# EAGLE design aduinobasic (EAGLE 6.3)
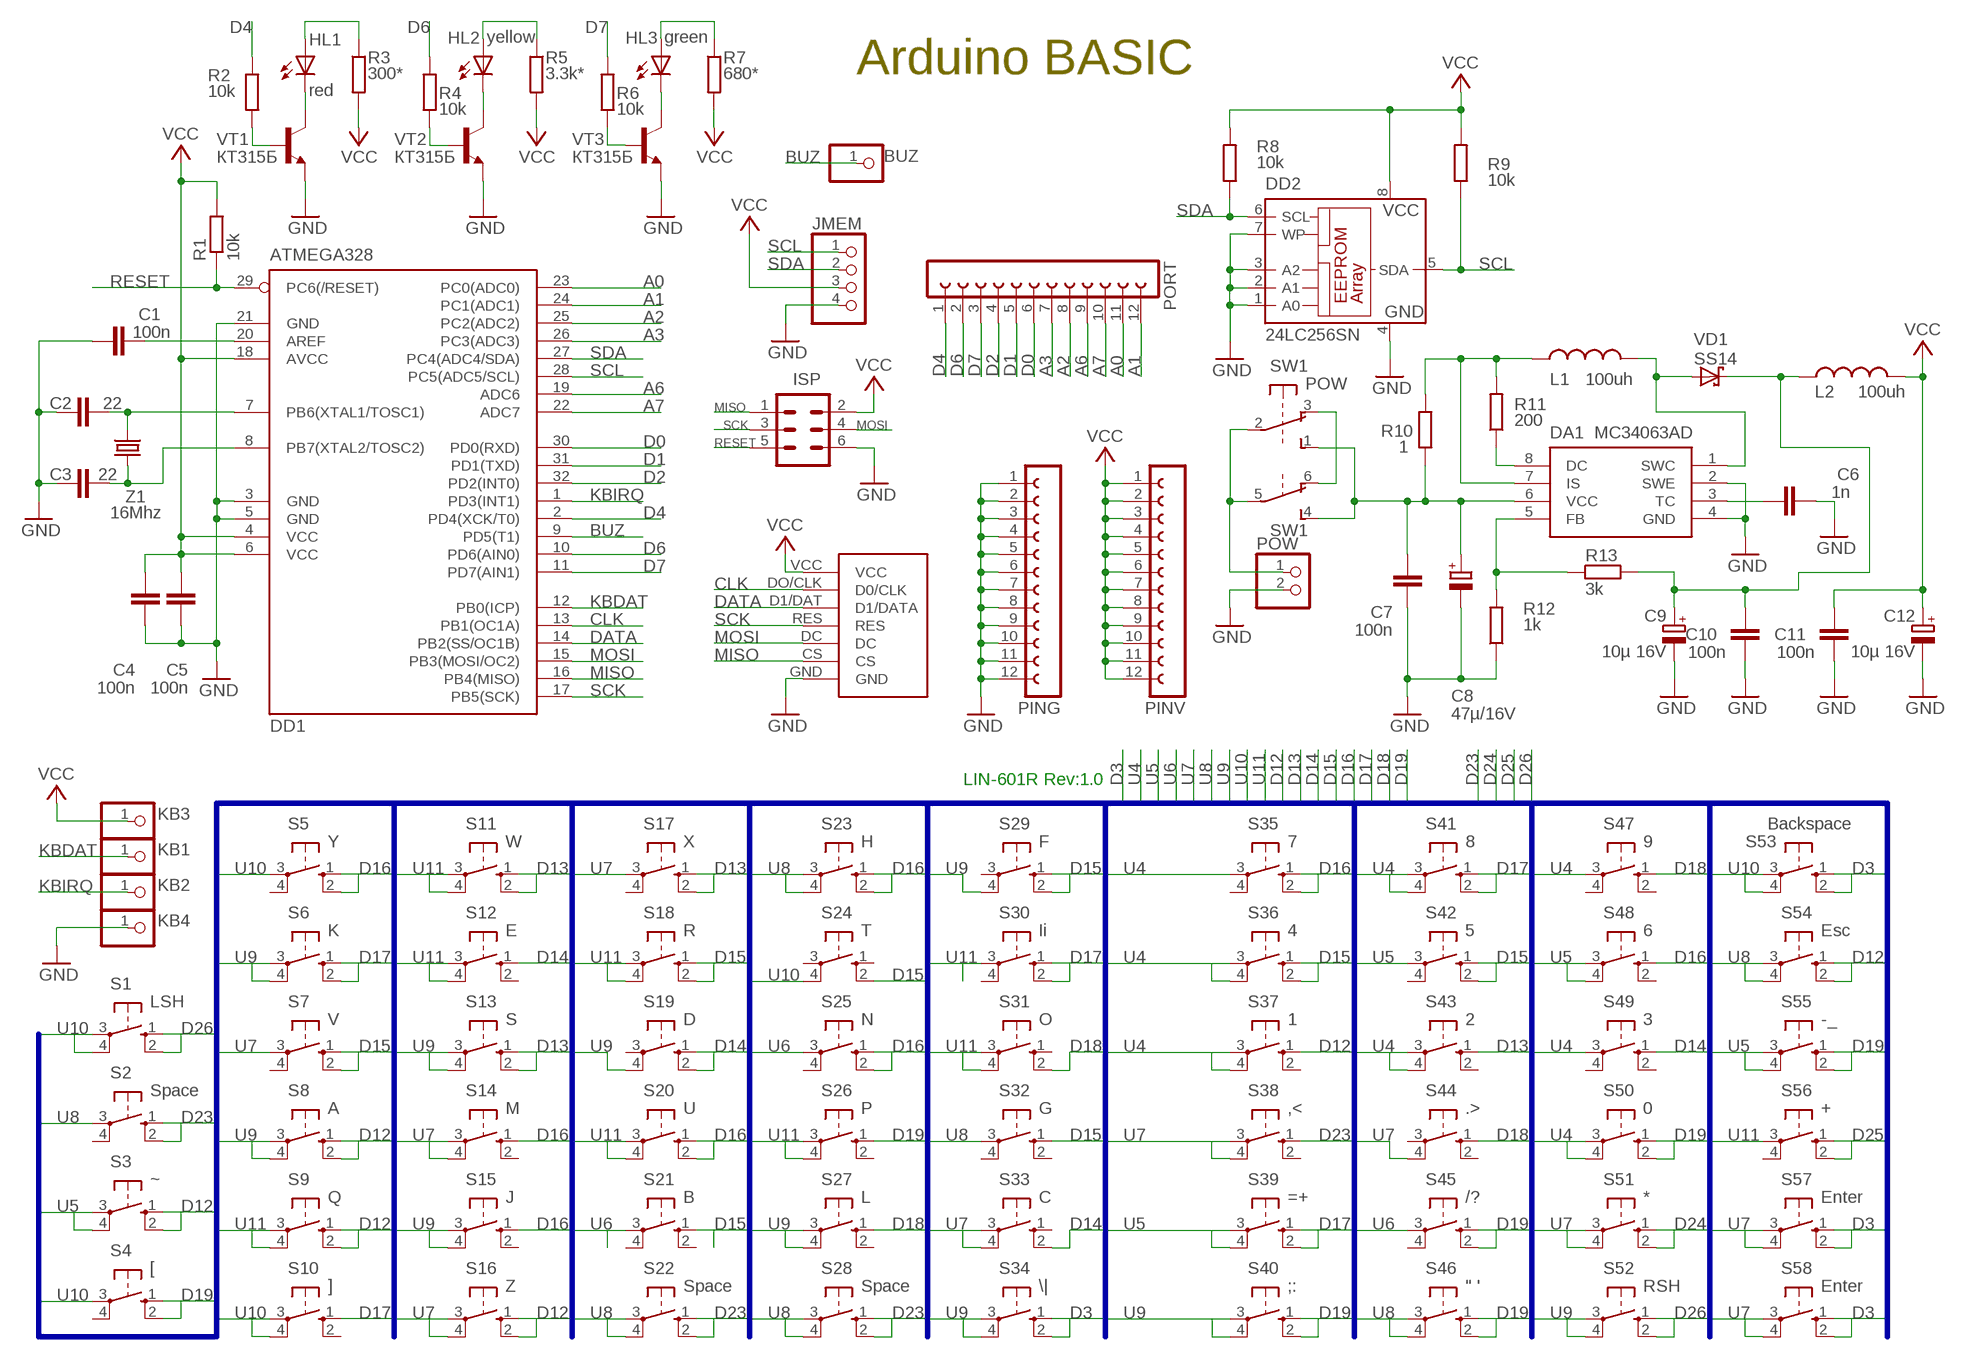
[diagram p0: schematic, sheet 1]

## Parts
BUZ  PINHD-1X1  [1X01]
C1  100n  C-EUC0805  [C0805]
C2  22  C-EU025-025X050  [C025-025X050]
C3  22  C-EU025-025X050  [C025-025X050]
C4  100n  C-EUC0805  [C0805]
C5  100n  C-EUC0805  [C0805]
C6  1n  C-EU025-025X050  [C025-025X050]
C7  100n  C-EUC1206  [C1206]
C8  47µ/16V  RCL_CPOL-EUE2-5  [RCL_E2-5]
C9  10µ 16V  RCL_CPOL-EUE2-5  [RCL_E2-5]
C10  100n  C-EUC1206  [C1206]
C11  100n  C-EUC1206  [C1206]
C12  10µ 16V  RCL_CPOL-EUE2-5  [RCL_E2-5]
DA1  MC34063AD  [SOIC8]
DD1  ATMEGA328  MEGA8-AI  [TQFP32-08]
DD2  24LC256SN  [SO-08]
DISPLAY  SSD1306  [SSD1306_0.96]
HL1  red  LED5MM  [LED5MM]
HL2  yellow  LED5MM  [LED5MM]
HL3  green  LED5MM  [LED5MM]
ISP  MA03-2  [MA03-2]
JMEM  PINHD-1X4  [1X04]
KB1  PINHD-1X1  [1X01]
KB2  PINHD-1X1  [1X01]
KB3  PINHD-1X1  [1X01]
KB4  PINHD-1X1  [1X01]
L1  100uh  L-US0207/10  [0207/10]
L2  100uh  L-US0204/5  [0204/5]
PING  FE12-1  [FE12]
PINV  FE12-1  [FE12]
PORT  FE12-1  [FE12]
POW  PINHD-1X2  [1X02]
R1  10k  R-EU_R0805  [R0805]
R2  10k  R-EU_R0805  [R0805]
R3  300*  R-EU_R1206W  [R1206W]
R4  10k  R-EU_R0805  [R0805]
R5  3.3k*  R-EU_R1206W  [R1206W]
R6  10k  R-EU_R0805  [R0805]
R7  680*  R-EU_R0805  [R0805]
R8  10k  R-EU_R0805  [R0805]
R9  10k  R-EU_R0805  [R0805]
R10  1  R-EU_M1206  [M1206]
R11  200  R-EU_M1206  [M1206]
R12  1k  R-EU_M0805  [M0805]
R13  3k  R-EU_M0805  [M0805]
S1  LSH  10-XX  [B3F-10XX]
S2  Space  10-XX  [B3F-10XX]
S3  ~  10-XX  [B3F-10XX]
S4  [  10-XX  [B3F-10XX]
S5  Y  10-XX  [B3F-10XX]
S6  K  10-XX  [B3F-10XX]
S7  V  10-XX  [B3F-10XX]
S8  A  10-XX  [B3F-10XX]
S9  Q  10-XX  [B3F-10XX]
S10  ]  10-XX  [B3F-10XX]
S11  W  10-XX  [B3F-10XX]
S12  E  10-XX  [B3F-10XX]
S13  S  10-XX  [B3F-10XX]
S14  M  10-XX  [B3F-10XX]
S15  J  10-XX  [B3F-10XX]
S16  Z  10-XX  [B3F-10XX]
S17  X  10-XX  [B3F-10XX]
S18  R  10-XX  [B3F-10XX]
S19  D  10-XX  [B3F-10XX]
S20  U  10-XX  [B3F-10XX]
S21  B  10-XX  [B3F-10XX]
S22  Space  10-XX  [B3F-10XX]
S23  H  10-XX  [B3F-10XX]
S24  T  10-XX  [B3F-10XX]
S25  N  10-XX  [B3F-10XX]
S26  P  10-XX  [B3F-10XX]
S27  L  10-XX  [B3F-10XX]
S28  Space  10-XX  [B3F-10XX]
S29  F  10-XX  [B3F-10XX]
S30  Ii  10-XX  [B3F-10XX]
S31  O  10-XX  [B3F-10XX]
S32  G  10-XX  [B3F-10XX]
S33  C  10-XX  [B3F-10XX]
S34  \|  10-XX  [B3F-10XX]
S35  7  10-XX  [B3F-10XX]
S36  4  10-XX  [B3F-10XX]
S37  1  10-XX  [B3F-10XX]
S38  ,<  10-XX  [B3F-10XX]
S39  =+  10-XX  [B3F-10XX]
S40  ;:  10-XX  [B3F-10XX]
S41  8  10-XX  [B3F-10XX]
S42  5  10-XX  [B3F-10XX]
S43  2  10-XX  [B3F-10XX]
S44  .>  10-XX  [B3F-10XX]
S45  /?  10-XX  [B3F-10XX]
S46  " '  10-XX  [B3F-10XX]
S47  9  10-XX  [B3F-10XX]
S48  6  10-XX  [B3F-10XX]
S49  3  10-XX  [B3F-10XX]
S50  0  10-XX  [B3F-10XX]
S51  *  10-XX  [B3F-10XX]
S52  RSH  10-XX  [B3F-10XX]
S53  Backspace  10-XX  [B3F-10XX]
S54  Esc  10-XX  [B3F-10XX]
S55  -_  10-XX  [B3F-10XX]
S56  +  10-XX  [B3F-10XX]
S57  Enter  10-XX  [B3F-10XX]
S58  Enter  10-XX  [B3F-10XX]
SW1  POW  9077-2  [9077-2]
VD1  SS14  SCHOTTKY-DIODESMD  [SMB]
VT1  КТ315Б  BC368-NPN-TO92-ECB  [TO92-ECB]
VT2  КТ315Б  BC368-NPN-TO92-ECB  [TO92-ECB]
VT3  КТ315Б  BC368-NPN-TO92-ECB  [TO92-ECB]
Z1  16Mhz  CRYSTALHC49S  [HC49/S]

## Nets
A0: DD1.23(PC0(ADC0)) PORT.11
A1: DD1.24(PC1(ADC1)) PORT.12
A2: DD1.25(PC2(ADC2)) PORT.8
A3: DD1.26(PC3(ADC3)) PORT.7
A6: DD1.19(ADC6) PORT.9
A7: DD1.22(ADC7) PORT.10
AREF: C1.2 DD1.20(AREF)
BUZ: BUZ.1 DD1.9(PD5(T1))
CLK: DD1.13(PB1(OC1A)) DISPLAY.DO/CLK(D0/CLK)
D0: DD1.30(PD0(RXD)) PORT.6
D1: DD1.31(PD1(TXD)) PORT.5
D2: DD1.32(PD2(INT0)) PORT.4
D3: S34.1(S) S34.2(S1) S53.1(S) S53.2(S1) S57.1(S) S57.2(S1) S58.1(S) S58.2(S1)
D4: DD1.2(PD4(XCK/T0)) PORT.1 R2.1
D6: DD1.10(PD6(AIN0)) PORT.2 R4.1
D7: DD1.11(PD7(AIN1)) PORT.3 R6.1
D12: S3.1(S) S3.2(S1) S8.1(S) S8.2(S1) S9.1(S) S9.2(S1) S16.1(S) S16.2(S1) S37.1(S) S54.1(S) S54.2(S1)
D13: S11.1(S) S11.2(S1) S13.1(S) S13.2(S1) S17.1(S) S17.2(S1) S43.1(S)
D14: S12.1(S) S19.1(S) S19.2(S1) S33.2(S1) S49.1(S)
D15: S7.1(S) S7.2(S1) S18.1(S) S18.2(S1) S21.1(S) S24.2(S1) S29.1(S) S29.2(S1) S32.1(S) S36.1(S) S36.2(S1) S42.1(S) S42.2(S1)
D16: S5.1(S) S5.2(S1) S14.1(S) S15.1(S) S20.1(S) S20.2(S1) S23.1(S) S23.2(S1) S25.1(S) S25.2(S1) S35.1(S) S35.2(S1) S48.1(S)
D17: S6.1(S) S6.2(S1) S10.1(S) S30.1(S) S30.2(S1) S39.1(S) S39.2(S1) S41.1(S) S41.2(S1)
D18: S27.1(S) S31.2(S1) S44.1(S) S47.1(S)
D19: S4.1(S) S4.2(S1) S26.1(S) S40.1(S) S40.2(S1) S45.1(S) S45.2(S1) S46.1(S) S46.2(S1) S50.1(S) S50.2(S1) S55.1(S) S55.2(S1)
D23: S2.1(S) S2.2(S1) S22.1(S) S22.2(S1) S28.1(S) S28.2(S1) S38.1(S)
D24: S51.1(S) S51.2(S1)
D25: S56.1(S) S56.2(S1)
D26: S1.1(S) S1.2(S1) S52.1(S) S52.2(S1)
DATA: DD1.14(PB2(SS/OC1B)) DISPLAY.D1/DAT(D1/DATA)
GND: C1.1 C2.1 C3.1 C4.2 C5.2 C6.2 C7.2 C8.- C9.- C10.1 C11.1 C12.- DA1.2(SWE) DA1.4(GND) DD1.3(GND) DD1.5(GND) DD1.21(GND) DD2.1(A0) DD2.2(A1) DD2.3(A2) DD2.4(GND) DD2.7(WP) DISPLAY.GND ISP.6 JMEM.4 KB4.1 PING.1 PING.2 PING.3 PING.4 PING.5 PING.6 PING.7 PING.8 PING.9 PING.10 PING.11 PING.12 POW.2 R12.1 VT1.E VT2.E VT3.E
KBDAT: DD1.12(PB0(ICP)) KB1.1
KBIRQ: DD1.1(PD3(INT1)) KB2.1
MISO: DD1.16(PB4(MISO)) DISPLAY.CS ISP.1
MOSI: DD1.15(PB3(MOSI/OC2)) DISPLAY.DC ISP.4
N$1: C2.2 DD1.7(PB6(XTAL1/TOSC1)) Z1.2
N$2: C3.2 DD1.8(PB7(XTAL2/TOSC2)) Z1.1
N$3: C7.1 C8.+ DA1.6(VCC) R10.1 SW1.1(1:S) SW1.4(2:S)
N$4: POW.1 SW1.2(1:P) SW1.5(2:P)
N$5: DA1.8(DC) R11.1
N$6: DA1.7(IS) L1.1 R10.2 R11.2
N$7: DA1.5(FB) R12.2 R13.1
N$8: DA1.1(SWC) L1.2 VD1.A
N$9: C6.1 DA1.3(TC)
N$10: SW1.3(1:O) SW1.6(2:O)
N$11: HL1.K(C) VT1.C
N$12: R2.2 VT1.B
N$13: HL1.A R3.1
N$14: HL2.K(C) VT2.C
N$15: R4.2 VT2.B
N$16: HL2.A R5.1
N$17: HL3.K(C) VT3.C
N$18: R6.2 VT3.B
N$19: HL3.A R7.1
N$21: C9.+ C10.2 L2.1 R13.2 VD1.C
RESET: DD1.29(PC6(/RESET)) ISP.5 R1.1
SCK: DD1.17(PB5(SCK)) DISPLAY.RES ISP.3
SCL: DD1.28(PC5(ADC5/SCL)) DD2.5(SDA) JMEM.1 R9.1
SDA: DD1.27(PC4(ADC4/SDA)) DD2.6(SCL) JMEM.2 R8.1
U4: S35.3(P) S36.3(P) S36.4(P1) S37.3(P) S37.4(P1) S41.3(P) S41.4(P1) S43.3(P) S43.4(P1) S47.3(P) S49.3(P) S50.3(P) S50.4(P1)
U5: S3.3(P) S3.4(P1) S39.3(P) S39.4(P1) S42.3(P) S48.3(P) S48.4(P1) S55.3(P) S55.4(P1)
U6: S21.3(P) S25.3(P) S45.3(P)
U7: S7.3(P) S14.3(P) S14.4(P1) S16.3(P) S16.4(P1) S17.3(P) S33.3(P) S33.4(P1) S38.3(P) S38.4(P1) S44.4(P1) S51.3(P) S51.4(P1) S57.3(P) S57.4(P1) S58.3(P) S58.4(P1)
U8: S2.3(P) S22.3(P) S22.4(P1) S23.3(P) S23.4(P1) S28.3(P) S28.4(P1) S32.3(P) S46.3(P) S46.4(P1) S54.3(P) S54.4(P1)
U9: S6.3(P) S6.4(P1) S8.3(P) S8.4(P1) S13.3(P) S13.4(P1) S15.3(P) S15.4(P1) S19.4(P1) S27.3(P) S27.4(P1) S29.4(P1) S34.3(P) S34.4(P1) S40.3(P) S40.4(P1) S52.3(P) S52.4(P1)
U10: S1.3(P) S1.4(P1) S4.3(P) S5.3(P) S10.3(P) S10.4(P1) S24.4(P1) S53.3(P) S53.4(P1)
U11: S9.3(P) S9.4(P1) S11.3(P) S11.4(P1) S12.3(P) S12.4(P1) S18.3(P) S18.4(P1) S20.3(P) S20.4(P1) S26.3(P) S26.4(P1) S30.3(P) S31.3(P) S31.4(P1) S56.3(P)
VCC: C4.1 C5.1 C11.2 C12.+ DD1.4(VCC) DD1.6(VCC) DD1.18(AVCC) DD2.8(VCC) DISPLAY.VCC ISP.2 JMEM.3 KB3.1 L2.2 PINV.1 PINV.2 PINV.3 PINV.4 PINV.5 PINV.6 PINV.7 PINV.8 PINV.9 PINV.10 PINV.11 PINV.12 R1.2 R3.2 R5.2 R7.2 R8.2 R9.2
Unconnected: S2.4(P1) S4.4(P1) S5.4(P1) S7.4(P1) S10.2(S1) S12.2(S1) S14.2(S1) S15.2(S1) S17.4(P1) S19.3(P) S21.2(S1) S21.4(P1) S24.1(S) S24.3(P) S25.4(P1) S26.2(S1) S27.2(S1) S29.3(P) S30.4(P1) S31.1(S) S32.2(S1) S32.4(P1) S33.1(S) S35.4(P1) S37.2(S1) S38.2(S1) S42.4(P1) S43.2(S1) S44.2(S1) S44.3(P) S45.4(P1) S47.2(S1) S47.4(P1) S48.2(S1) S49.2(S1) S49.4(P1) S56.4(P1)

## Buses
U[4..11],D[1..3],D[12..19],D[21..28]

## Notes on the sheet
- Arduino BASIC
- LIN-601R Rev:1.0

## Library data of the parts
BUZ KB1-KB4 = pinhead:PINHD-1X1: PIN HEADER
C1-C6 C10 C11 = rcl:C-EU: CAPACITOR, European symbol
C7 = rc-elektronik:C-EU: CAPACITOR, European symbol
C8 C9 C12 = HWProgUSB:RCL_CPOL-EU: POLARIZED CAPACITOR, European symbol
DA1 = mc34063:MC34063
DD1 = atmel:MEGA8: MICROCONTROLLER 8 Kbytes FLASH, 1 kbytes SRAM, 512 bytes EEPROM, USART, 6-channel 10 bit ADC, 2-channel 8 bit ADC Pin compatible with Atmega48, ATMega88, ATMega168 Source: avr.lbr; MPN: ATMEGA8-16AU; OC_FARNELL: 9171371; OC_NEWARK: 73M8863
DD2 = microchip:24*: Serial EEPROM I2C; MF: MICROCHIP; MPN: 24LC256-I/SN; OC_FARNELL: 9757996; OC_NEWARK: 27C9144
DISPLAY = ArduinoBASIC:SSD1306
HL1-HL3 = ArduinoBASIC:LED: LED OSRAM: - CHIPLED LG R971, LG N971, LY N971, LG Q971, LY Q971, LO R971, LY R971 LH N974, LH R974 LS Q976, LO Q976, LY Q976 LO Q996 - Hyper CHIPLED LW Q18S LB Q993, LB Q99A, LB R99A - SideLED LS A670, LO A670, LY A670, LG A670, LP A670 LB A673, LV A673, LT A673, LW A673 LH A674 LY A675 LS A676, LA A676, LO A676, LY A676, LW A676 LS A679, LY A679, LG A679 - Hyper Micro SIDELED® LS Y876, LA Y876, LO Y876, LY Y876 LT Y87S - SmartLED LW L88C, LW L88S LB L89C, LB L89S, LG L890 LS L89K, LO L89K, LY L89K LS L896, LA L896, LO L896, LY L896 - TOPLED LS T670, LO T670, LY T670, LG T670, LP T670 LSG T670, LSP T670, LSY T670, LOP T670, LYG T670 LG T671, LOG T671, LSG T671 LB T673, LV T673, LT T673, LW T673 LH T674 LS T676, LA T676, LO T676, LY T676, LB T676, LH T676, LSB T676, LW T676 LB T67C, LV T67C, LT T67C, LS T67K, LO T67K, LY T67K, LW E67C LS E67B, LA E67B, LO E67B, LY E67B, LB E67C, LV E67C, LT E67C LW T67C LS T679, LY T679, LG T679 LS T770, LO T770, LY T770, LG T770, LP T770 LB T773, LV T773, LT T773, LW T773 LH T774 LS E675, LA E675, LY E675, LS T675 LS T776, LA T776, LO T776, LY T776, LB T776 LHGB T686 LT T68C, LB T68C - Hyper Mini TOPLED® LB M676 - Mini TOPLED Santana® LG M470 LS M47K, LO M47K, LY M47K Source: http://www.osram.convergy.de LUXEON: - LUMILED® LXK2-PW12-R00, LXK2-PW12-S00, LXK2-PW14-U00, LXK2-PW14-V00 LXK2-PM12-R00, LXK2-PM12-S00, LXK2-PM14-U00 LXK2-PE12-Q00, LXK2-PE12-R00, LXK2-PE12-S00, LXK2-PE14-T00, LXK2-PE14-U00 LXK2-PB12-K00, LXK2-PB12-L00, LXK2-PB12-M00, LXK2-PB14-N00, LXK2-PB14-P00, LXK2-PB14-Q00 LXK2-PR12-L00, LXK2-PR12-M00, LXK2-PR14-Q00, LXK2-PR14-R00 LXK2-PD12-Q00, LXK2-PD12-R00, LXK2-PD12-S00 LXK2-PH12-R00, LXK2-PH12-S00 LXK2-PL12-P00, LXK2-PL12-Q00, LXK2-PL12-R00 Source: www.luxeon.com KINGBRIGHT: KA-3528ASYC Source: www.kingbright.com
ISP = con-lstb:MA03-2: PIN HEADER
JMEM = ArduinoBASIC:PINHD-1X4: PIN HEADER
L1 L2 = rcl:L-US: INDUCTOR, American symbol
PING PINV PORT = ArduinoBASIC:FE12-1: FEMALE HEADER; OC_FARNELL: unknown; OC_NEWARK: unknown
POW = pinhead:PINHD-1X2: PIN HEADER
R1-R13 = rcl:R-EU_: RESISTOR, European symbol
S1-S58 = ArduinoBASIC:10-XX: OMRON SWITCH; MPN: B3F-1000; OC_FARNELL: 176432; OC_NEWARK: 36M3542
SW1 = ArduinoBASIC:9077-2: MARQUARDT SWITCH 9077.0200 Distributor: Buerklin <https://www.buerklin.com/default.asp?event=ShowArtikel%2812G2822%29&l=d&jump=ArtNr_12G2822>
VD1 = diode:SCHOTTKY-DIODE: Schottky Diode
VT1-VT3 = transistor:*-NPN-: NPN Transistror BF959 corrected 2008.03.06
Z1 = crystal:CRYSTAL: CRYSTAL; OC_FARNELL: 1667008; OC_NEWARK: unknown

## Board
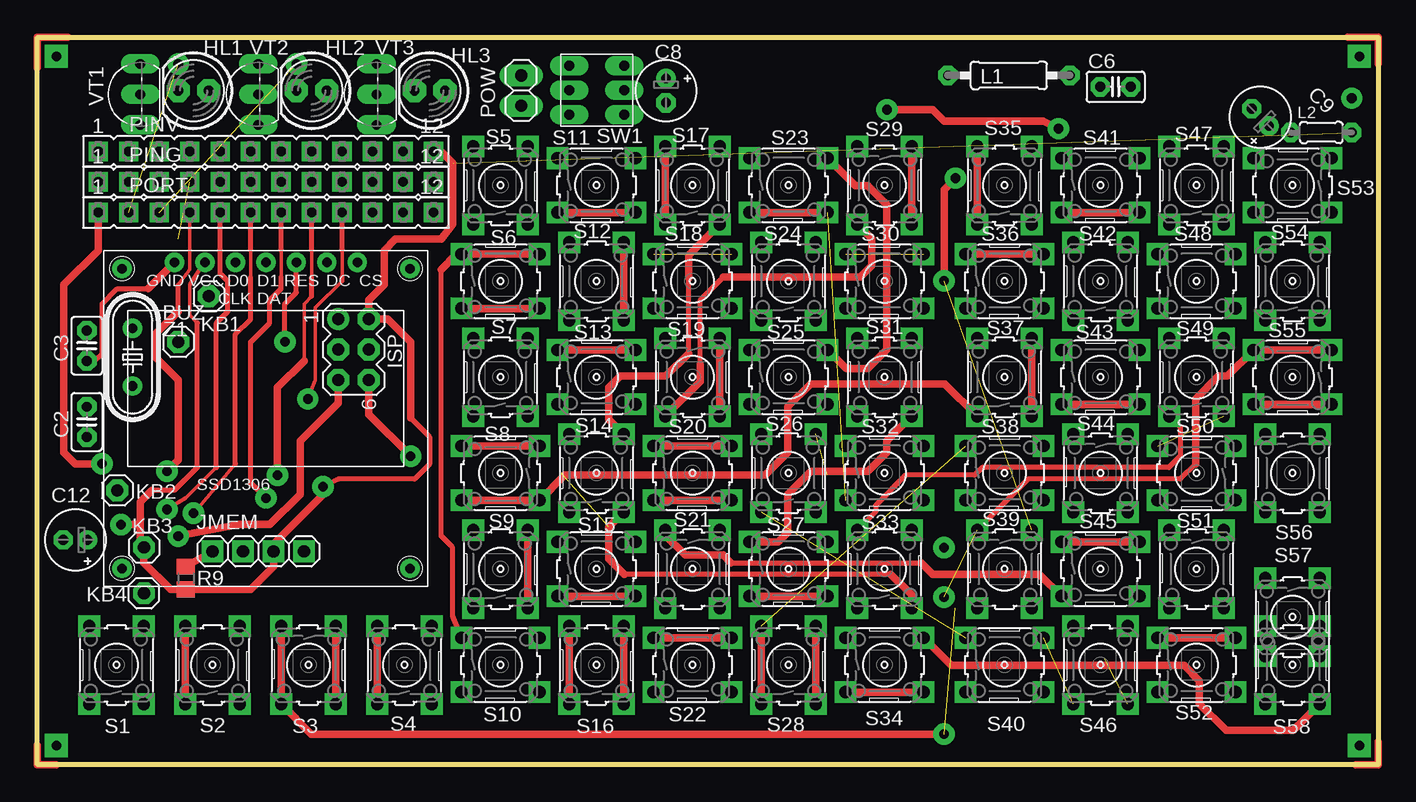
[diagram p1: board, top side]
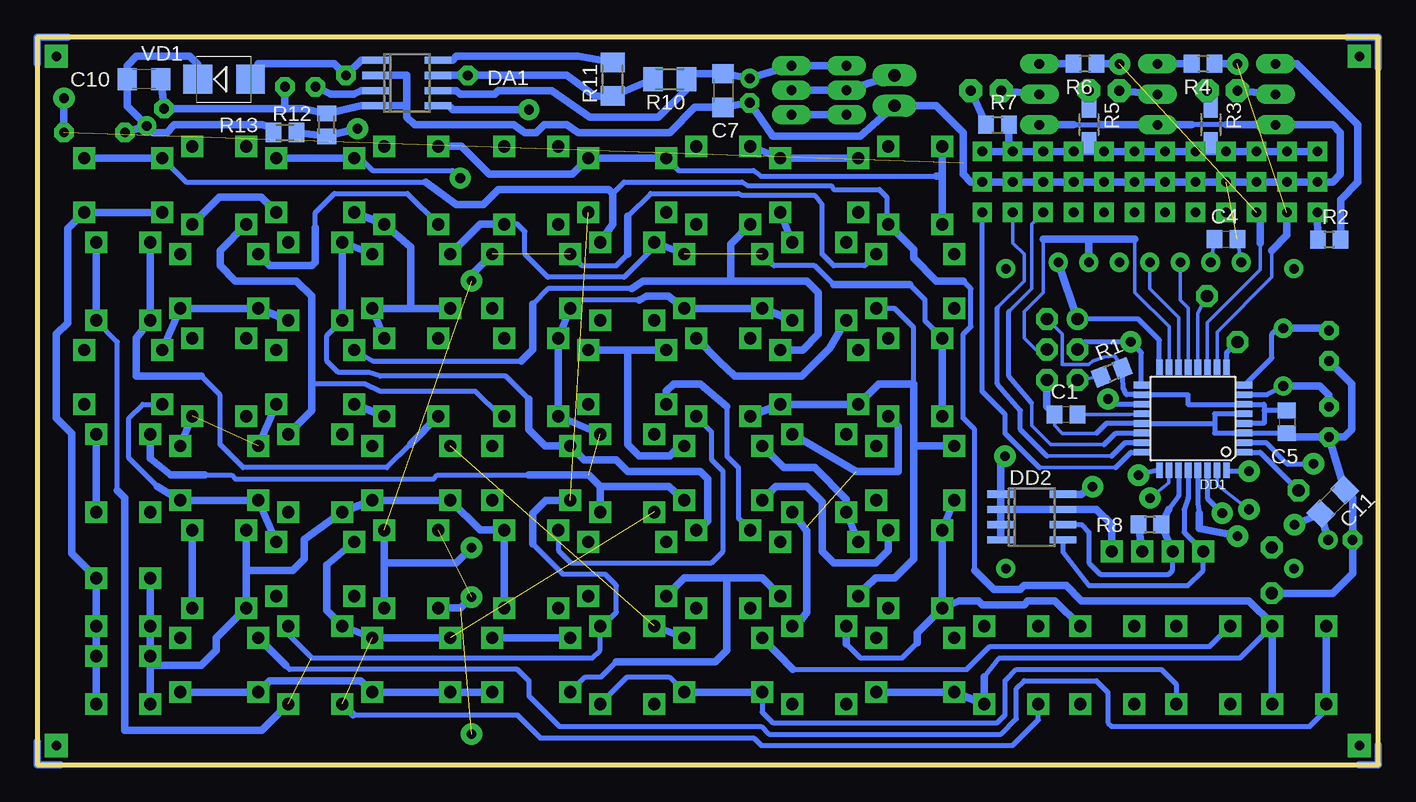
[diagram p2: board, bottom side, seen from below]

Size 111.76 x 60.64 mm. Coordinates in mm from the lower left corner, seen from the top.
Outline: 0,60.64 111.76,60.64 111.76,0 0,0 0,60.64
Copper layers (1*16): Top 0.035mm / dielectric 1.5mm / Bottom 0.035mm
Design rules "ArduinoBASIC": minimum track width 10mil, minimum drill 24mil, track to track 8mil, track to pad 8mil, pad to pad 8mil, via to via 8mil, smd to smd 8mil, copper to edge 40mil, drill to drill 7mil, minimum pad ring 0.4mm, minimum via ring 8mil, stop-mask expansion 4mil, vias tented up to drill 0mil, thermal gap 10mil

### Footprints (pad centres in the part's own frame; a part is rotated, then mirrored left to right if it is on the bottom)
1X01 = drill 1.016 octagon: 1 0,0
C0805 = smd 1.3 x 1.5: 1 -0.95,0; 2 0.95,0
C025-025X050 = drill 0.813 octagon: 1 -1.27,0; 2 1.27,0
C1206 = smd 1.6 x 1.8: 1 -1.4,0; 2 1.4,0
RCL_E2-5 = drill 0.813 pad 1.27: + -1.016,0 | drill 0.813 pad 1.27 octagon: - 1.016,0
SOIC8 = smd 0.6 x 2.2: 1 -1.905,-2.6; 2 -0.635,-2.6; 3 0.635,-2.6; 4 1.905,-2.6; 5 1.905,2.6; 6 0.635,2.6; 7 -0.635,2.6; 8 -1.905,2.6
TQFP32-08 = smd 1.27 x 0.559: 1 -4.293,2.8; 2 -4.293,2; 3 -4.293,1.2; 4 -4.293,0.4; 5 -4.293,-0.4; 6 -4.293,-1.2; 7 -4.293,-2; 8 -4.293,-2.8; 17 4.293,-2.8; 18 4.293,-2; 19 4.293,-1.2; 20 4.293,-0.4; 21 4.293,0.4; 22 4.293,1.2; 23 4.293,2; 24 4.293,2.8 | smd 0.559 x 1.27: 9 -2.8,-4.293; 10 -2,-4.293; 11 -1.2,-4.293; 12 -0.4,-4.293; 13 0.4,-4.293; 14 1.2,-4.293; 15 2,-4.293; 16 2.8,-4.293; 25 2.8,4.293; 26 2,4.293; 27 1.2,4.293; 28 0.4,4.293; 29 -0.4,4.293; 30 -1.2,4.293; 31 -2,4.293; 32 -2.8,4.293
SO-08 = smd 0.6 x 2.2: 1 -1.905,-2.6; 2 -0.635,-2.6; 3 0.635,-2.6; 4 1.905,-2.6; 5 1.905,2.6; 6 0.635,2.6; 7 -0.635,2.6; 8 -1.905,2.6
SSD1306_0.96 = drill 0.8: CS 7.62,10.12; D1/DAT 0,10.12; DC 5.08,10.12; DO/CLK -2.54,10.12; GND -7.62,10.12; P$1 -12,9.6; P$2 12,9.6; P$3 12,-15.4; P$4 -12,-15.4; RES 2.54,10.12; VCC -5.08,10.12
LED5MM = drill 0.813 pad 1.93 octagon: A -1.27,0; K 1.27,0
MA03-2 = drill 1.016: 1 -2.54,-1.27 | drill 1.016 octagon: 2 -2.54,1.27; 3 0,-1.27; 4 0,1.27; 5 2.54,-1.27; 6 2.54,1.27
1X04 = drill 1.016 square: 1 -3.81,0; 2 -1.27,0; 3 1.27,0; 4 3.81,0
0207/10 = drill 0.813 octagon: 1 -5.08,0; 2 5.08,0
0204/5 = drill 0.813 octagon: 1 -2.54,0; 2 2.54,0
FE12 = drill 0.813 square: 1 -13.97,0; 2 -11.43,0; 3 -8.89,0; 4 -6.35,0; 5 -3.81,0; 6 -1.27,0; 7 1.27,0; 8 3.81,0; 9 6.35,0; 10 8.89,0; 11 11.43,0; 12 13.97,0
1X02 = drill 1.016 long: 1 -1.27,0; 2 1.27,0
R0805 = smd 1.3 x 1.5: 1 -0.95,0; 2 0.95,0
R1206W = smd 1.8 x 1.2: 1 -1.499,0; 2 1.499,0
M1206 = smd 1.6 x 2: 1 -1.4,0; 2 1.4,0
M0805 = smd 1.3 x 1.6: 1 -0.95,0; 2 0.95,0
B3F-10XX = drill 1.016 square: 1 -3.251,2.261; 2 3.251,2.261; 3 -3.251,-2.261; 4 3.251,-2.261
9077-2 = drill 0.813 long: 1 -2.04,2.29; 2 0,2.29; 3 2.04,2.29; 4 -2.04,-2.29; 5 0,-2.29; 6 2.04,-2.29
SMB = smd 2.4 x 2.4: A 2.2,0; C -2.2,0
TO92-ECB = drill 0.813 long: B 2.54,0; C 0,0; E -2.54,0
HC49/S = drill 0.813: 1 -2.413,0; 2 2.413,0

### Placement (x,y rotation side)
BUZ  11.75,35.24 0 top
C1  26.04,29.21 0 bottom
C2  4.13,28.57 90 top
C3  4.13,34.93 90 top
C4  12.7,43.82 0 bottom
C5  7.62,28.57 270 bottom
C6  89.85,56.52 0 top
C7  54.61,56.2 270 bottom
C8  52.39,56.2 270 top
C9  101.92,53.98 135 top
C10  102.87,57.15 180 bottom
C11  3.81,21.91 225 bottom
C12  3.17,18.73 180 top
DA1  80.96,56.83 270 bottom
DD1  15.45,28.84 180 bottom
DD2  28.89,20.64 270 bottom
DISPLAY  19.05,31.75 0 top
HL1  13.02,56.2 180 top
HL2  22.86,56.2 180 top
HL3  32.7,56.2 180 top
ISP  26.35,34.61 270 top
JMEM  18.41,17.78 0 top
KB1  14.29,39.05 0 top
KB2  6.67,22.86 0 top
KB3  8.89,18.1 0 top
KB4  8.89,14.29 180 top
L1  80.96,57.47 0 top
L2  107,52.71 0 top
PING  19.05,48.58 0 top
PINV  19.05,51.12 0 top
PORT  19.05,46.04 0 top
POW  40.32,56.2 270 top
R1  22.22,32.7 22 bottom
R2  4.09,43.79 0 bottom
R3  13.97,53.34 270 bottom
R4  14.61,58.42 180 bottom
R5  24.13,53.34 270 bottom
R6  24.45,58.42 180 bottom
R7  31.75,53.34 0 bottom
R8  19.05,20 180 bottom
R9  12.38,15.56 270 top
R10  59.05,57.15 180 bottom
R11  63.82,57.15 270 bottom
R12  87.63,53.34 270 bottom
R13  91.12,52.71 180 bottom
S1  6.6,8.3 90 top
S2  14.6,8.3 90 top
S3  22.6,8.3 270 top
S4  30.6,8.3 90 top
S5  38.6,48.3 90 top
S6  38.6,40.3 0 top
S7  38.6,32.3 90 top
S8  38.6,24.3 180 top
S9  38.6,16.3 90 top
S10  38.6,8.3 0 top
S11  46.6,48.3 0 top
S12  46.6,40.3 90 top
S13  46.6,32.3 0 top
S14  46.6,24.3 90 top
S15  46.6,16.3 0 top
S16  46.6,8.3 90 top
S17  54.6,48.3 90 top
S18  54.6,40.3 0 top
S19  54.6,32.3 270 top
S20  54.6,24.3 0 top
S21  54.6,16.3 270 top
S22  54.6,8.3 0 top
S23  62.6,48.3 0 top
S24  62.6,40.3 90 top
S25  62.6,32.3 0 top
S26  62.6,24.3 90 top
S27  62.6,16.3 0 top
S28  62.6,8.3 90 top
S29  70.6,48.3 270 top
S30  70.6,40.3 0 top
S31  70.6,32.3 270 top
S32  70.6,24.3 0 top
S33  70.6,16.3 90 top
S34  70.6,8.3 0 top
S35  80.6,48.3 90 top
S36  80.6,40.3 0 top
S37  80.6,32.3 90 top
S38  80.6,24.3 0 top
S39  80.6,16.3 270 top
S40  80.6,8.3 0 top
S41  88.6,48.3 0 top
S42  88.6,40.3 90 top
S43  88.6,32.3 0 top
S44  88.6,24.3 270 top
S45  88.6,16.3 0 top
S46  88.6,8.3 90 top
S47  96.6,48.3 90 top
S48  96.6,40.3 0 top
S49  96.6,32.3 90 top
S50  96.6,24.3 180 top
S51  96.6,16.3 270 top
S52  96.6,8.3 0 top
S53  104.6,48.3 180 top
S54  104.6,40.3 90 top
S55  104.6,32.3 180 top
S56  104.6,24.3 270 top
S57  104.6,12.3 270 top
S58  104.6,8.3 270 top
SW1  46.62,56.23 270 top
VD1  96.2,57.15 0 bottom
VT1  8.57,55.88 90 top
VT2  18.41,55.88 90 top
VT3  28.26,55.88 90 top
Z1  7.94,33.97 270 top

### Tracks (layer width: path | path; a pad name or v marks a point on that pad's centre or on a via)
A0
  Bottom 0.305: 31.75,38.1 29.53,40.32 29.53,42.55 30.48,43.5 PORT.11 | 27.62,25.72 22.22,25.72
  Bottom 0.406: 22.22,25.72 21.1,26.84 DD1.23 | 27.62,25.72 29.84,27.94 29.84,29.53 31.75,31.75 31.75,38.1
A1
  Bottom 0.305: 28.26,24.76 21.91,24.76 | 20.07,26.04 DD1.24
  Bottom 0.406: 21.91,24.76 20.64,26.04 20.07,26.04 | 28.26,24.76 31.11,27.62 31.11,29.21 33.02,31.11 PORT.12
A2  (via drill 0.8 pad 1.78)
  Top 0.305: 22.22,33.66 22.22,38.42 22.86,39.05 | 22.86,40.64 22.86,42.86
  Top 0.406: 22.86,39.05 22.86,40.64 | 22.86,42.86 PORT.8
  Top 0.61: v20,24.13 20,31.43 22.22,33.66
  Bottom 0.406: DD1.25 v20,24.13
A3  (via drill 0.8 pad 1.78)
  Top 0.305: 20.32,40.64 20.32,42.86
  Top 0.406: v19.05,22.22 17.78,23.49 17.78,35.24 19.37,36.83 19.37,38.73 20.32,39.69 20.32,40.64 | 20.32,42.86 PORT.7
  Bottom 0.305: DD1.26 17.46,23.9 17.46,23.49 v19.05,22.22
A6  (via drill 0.8 pad 1.78)
  Top 0.305: v22.54,30.48 23.18,32.07 23.18,38.1 25.4,40.32 | 25.4,40.64 25.4,42.86
  Top 0.406: 25.4,40.32 25.4,40.64 | 25.4,42.86 PORT.9
  Bottom 0.406: DD1.19 21.79,30.04 v22.54,30.48
A7
  Bottom 0.305: 30.8,37.78 28.89,39.69 28.89,45.09 PORT.10 | 22.86,26.67 27.3,26.67 28.89,28.26 28.89,30.16
  Bottom 0.406: 22.86,26.67 21.89,27.64 DD1.22 | 28.89,30.16 30.8,32.39 30.8,37.78
AREF
  Bottom 0.305: DD1.20 20.7,29.21 C1.2
BUZ
  Bottom 0.406: DD1.9 12.65,34.34 BUZ.1
CLK
  Bottom 0.305: DD1.13 15.85,38.08 16.51,38.73 DISPLAY.DO/CLK
D0  (via drill 0.8 pad 1.78)
  Top 0.305: v13.02,20.95 16.51,25.08 | 17.78,40.64 17.78,42.86
  Top 0.406: 16.51,25.08 16.51,35.88 17.78,37.15 17.78,40.64 | 17.78,42.86 PORT.6
  Bottom 0.406: DD1.30 14.25,22.19 v13.02,20.95
D1  (via drill 0.8 pad 1.78)
  Top 0.305: v10.79,21.27 12.38,22.22 14.92,24.76
  Top 0.406: 14.92,24.76 14.92,36.83 15.88,37.78 15.88,40.32 15.24,40.96 PORT.5
  Bottom 0.305: DD1.31 13.45,23.29 v10.79,21.27
D2  (via drill 0.8 pad 1.78)
  Top 0.305: 11.75,40.01 12.7,41.27 PORT.4
  Top 0.406: 11.75,37.78 11.75,40.01
  Top 0.61: v10.79,24.45 11.75,25.4 11.75,32.07 9.84,33.97 9.84,35.88 11.75,37.78
  Bottom 0.406: v10.79,24.45 12.55,24.45 DD1.32
D3
  Top 0.61: S34.2 76.16,8.26 95.57,8.26 96.84,6.99 96.84,5.08 99.06,2.86 104.67,2.86 S58.2
  Bottom 0.61: S58.1 S57.1 | S57.1 S58.2 S57.2 | S53.1 | S34.1 S34.2 | S53.2 S53.1 | S53.1 109.22,44.67 109.22,36.83 110.17,35.88 110.17,28.89 108.9,27.62 108.9,17.59 S57.1
D4  (via drill 0.8 pad 1.78)
  Top 0.61: PORT.1 5.08,42.86 2.22,40.01 2.22,26.04 3.17,25.08 v5.4,25.08
  Bottom 0.406: DD1.2 9.38,26.84 7.62,25.08 v5.4,25.08
  Bottom 0.61: PORT.1 R2.1
D6  (via drill 0.8 pad 1.78)  (1 unrouted)
  Bottom 0.305: DD1.10 13.45,36.08 8.89,40.64 8.89,42.86
  Bottom 0.61: 8.89,42.86 7.62,44.13 PORT.2 | R4.1 v11.75,58.42
D7  (via drill 0.8 pad 1.78)  (1 unrouted)
  Bottom 0.305: DD1.11 14.25,36.87 9.84,41.27 9.84,43.5
  Bottom 0.61: 9.84,43.5 9.84,45.72 PORT.3 | R6.1 v21.59,58.42
D12
  Top 0.61: S3.2 S3.1 | S8.2 S8.1 43.94,24.13 60.64,24.13 62.55,26.04 62.55,29.84 64.45,31.75 75.64,31.75 S37.1 | S16.1 S16.2
  Bottom 0.406: 80.64,26.74 82.62,24.76 94.61,24.76 96.52,26.67 96.52,30.8 98.11,32.39 | 44.34,10.05 43.18,8.89 39.69,8.89 38.42,10.16
  Bottom 0.61: S9.2 S9.1 | S54.2 S54.1 103.5,35.57 103.5,32.39 98.11,32.39 | 80.64,26.74 S37.1 | S9.2 36.38,19.55 | S8.2 S9.2 | S9.1 34.93,13.65 33.34,13.65 33.02,13.34 29.53,13.34 29.21,13.65 26.96,13.65 S3.1 | S16.2 44.34,10.05 | 38.42,10.16 38.42,10.97 S9.1
D13
  Top 0.61: S17.1 S17.2 | S13.1 S13.2
  Bottom 0.406: 62.23,39.69 69.21,39.69 70.48,38.42 | S43.1 83.82,33.66 71.44,33.66
  Bottom 0.61: S17.2 S11.2 S11.1 | S13.2 47.99,34.56 46.67,35.88 46.67,39.37 47.62,40.32 53.98,40.32 | S17.1 53.98,43.41 53.98,40.32 | 53.98,40.32 61.28,40.32 62.23,39.69 | 71.44,33.66 70.48,34.61 70.48,38.42
D14
  Top 0.406: S49.1 95.25,28.14 95.25,25.72 94.3,24.76 78.74,24.76 78.1,24.13 72.39,24.13 69.85,21.59 69.85,21.06 S33.2
  Top 0.61: S19.2 S19.1
  Bottom 0.406: S33.2 68.34,17.86 67.31,16.83 55.56,16.83 54.61,17.78 54.61,24.45 55.56,25.4 55.56,27.75 S19.2
  Bottom 0.61: S12.1 45.72,34.72 48.05,32.39 53.66,32.39 54.93,33.62 S19.1
D15  (1 unrouted)
  Top 0.61: S36.1 S36.2 | S29.1 S29.2
  Bottom 0.406: S7.2 37.78,36.99 37.78,38.73 39.05,40.01 | 45.4,40.01 46.99,41.59 50.38,41.59 S18.1 | S24.2 60.34,43.17 62.87,40.64 69.21,40.64 71.12,42.55 71.12,44.45 71.75,45.09 71.79,45.05 S29.2 | 70.8,30.48 72.71,32.39 83.18,32.39 84.14,32.7 86.68,32.7 87.63,33.66 87.63,35.76 S42.1
  Bottom 0.61: S42.1 S42.2 S36.2 | S36.1 74.86,45.05 S29.2 | S24.2 S18.2 | S7.1 S7.2 | S21.1 56.65,19.55 55.88,20.32 55.88,23.81 56.52,24.45 62.55,24.45 63.5,25.4 66.19,25.4 S32.1 69.42,26.56 70.8,27.94 70.8,30.48 | 39.05,40.01 45.4,40.01
D16
  Top 0.61: S35.1 S35.2 | S20.1 S20.2 | S25.2 67.39,33.02 69.21,33.02 70.8,34.61 70.8,46.67 69.21,48.26 68.15,48.26 S23.2
  Bottom 0.406: 88.58,44.77 88.58,46.04 86.99,47.62 80.92,47.62 S35.1 | S23.1 58.32,49.53 52.07,49.53 51.44,49.05 36.83,49.05
  Bottom 0.61: S15.1 S14.1 44.34,22.11 46.99,24.76 49.55,24.76 S20.1 | S23.1 S23.2 67.2,49.21 74.1,49.21 76.43,51.55 S35.2 | S48.1 92.38,41.59 88.9,41.59 88.58,41.91 88.58,44.77 | S20.2 58.21,26.56 59.05,25.72 61.59,25.72 62.55,26.67 62.55,34.56 | S5.2 36.34,49.05 | 36.34,49.05 S5.1 | 36.83,49.05 36.34,49.05 | S25.2 62.55,34.56 | 62.55,34.56 S25.1
D17  (via drill 0.8 pad 1.78)  (2 unrouted)
  Top 0.406: S10.1 34.61,12.38 34.61,18.1 33.66,19.05 33.66,41.27 | 35.33,42.55 S6.1
  Top 0.61: S6.1 S6.2 | v76.52,48.9 75.56,47.94 v75.56,40.32 | 35.33,42.55 34.93,42.55 33.66,41.27
  Bottom 0.406: S41.1 84.85,50.56 83.82,49.53 77.15,49.53 v76.52,48.9 | 62.55,45.72 60.64,47.62 53.34,47.62 53.02,47.47 46.99,47.47 46.36,46.67 46.36,42.55 45.4,41.59 42.82,41.59 S6.2 | S30.1 66.38,41.59 63.5,41.59 62.55,42.55
  Bottom 0.61: S41.2 S41.1 | S39.2 82.86,16.83 | 82.86,16.83 S39.1 | v75.56,40.32 75.56,40.85 S30.2 | 62.55,42.55 62.55,45.72 | v75.56,18.1 76.83,16.83 82.86,16.83
D18
  Top 0.61: S27.1 61.74,18.56 62.55,19.37 62.55,22.54 64.45,24.45 69.21,24.45 70.8,26.04 70.8,26.99 S31.2
  Bottom 0.406: S31.2 73.18,29.05 75.25,31.11 83.18,31.11 84.45,31.75 88.9,31.75
  Bottom 0.61: S44.1 88.9,29.51 88.9,31.75 88.9,39.05 90.17,40.32 95.25,40.32 96.52,41.59 96.52,42.87 S47.1
D19  (2 unrouted)
  Top 0.61: S55.2 S55.1 | S45.1 S45.2 | S4.2 S4.1
  Bottom 0.406: 85.44,4.13 71.75,4.13 69.85,2.22 52.07,2.22 51.44,1.59 30.48,1.59 28.34,3.73 S4.1 | 101.76,23.18 104.14,25.56 104.14,28.89 102.99,30.04 S55.2
  Bottom 0.61: 101.76,23.18 S50.1 S50.2 S45.2 | S45.1 87.63,16.66 87.63,12.84 S46.2 S40.2 S40.1 | 85.44,4.13 86.34,5.03 S46.1
D23  (1 unrouted)
  Top 0.61: S22.2 S22.1 | S28.1 S28.2 | S2.2 S2.1
  Bottom 0.406: S2.2 14.05,9.84 32.39,9.84 34.29,7.94 48.81,7.94
  Bottom 0.61: S22.2 S28.2 | S22.1 48.81,7.94
D24
  Bottom 0.61: S51.2 S51.1
D25
  Bottom 0.61: S56.2 S56.1
D26
  Top 0.61: S52.2 S52.1
  Bottom 0.406: S1.1 4.34,4.55 5.71,3.17 22.22,3.17 22.54,3.49 22.54,6.03 23.49,6.99 29.53,6.99 30.16,6.35 30.16,3.81 31.43,2.54 50.8,2.54 51.44,3.17 68.26,3.17 70.8,5.71 70.8,6.99 71.75,7.94 90.73,7.94 91.04,8.26
  Bottom 0.61: S1.2 S1.1 | S52.1 91.04,8.26
DATA
  Bottom 0.305: DD1.14 16.65,37.29 19.05,39.69 DISPLAY.D1/DAT
GND  (via drill 0.8 pad 1.78)  (1 unrouted)
  Top 0.406: C3.1 4.76,33.66 5.4,34.29 5.4,38.42 6.67,39.69 9.25,39.69
  Top 0.61: 9.25,39.69 DISPLAY.GND | v31.11,25.72 27.62,29.21 ISP.6
  Bottom 0.305: 23.49,27.62 26.35,27.62 26.98,28.25 C1.1 | DISPLAY.GND C4.2
  Bottom 0.406: DD1.5 13.65,29.24 13.65,28.44 | 13.65,28.44 13.65,27.64 DD1.3 7.64,27.64 C5.2 | 13.65,28.44 DD1.21 22.67,28.44 23.49,27.62 | 25.4,53.34 23.18,53.34 | 12.7,53.34 15.56,53.34
  Bottom 0.61: C2.1 2.86,27.3 2.22,27.94 2.22,31.75 C3.1 | C2.1 7.3,27.3 C5.2 | 80.96,54.93 DA1.4 84.77,54.93 R12.1 89.62,54.69 91.12,54.69 | 80.96,54.93 80.96,57.47 DA1.2 | C10.1 C9.- 91.12,54.69 | 91.12,54.69 C6.2 | VT3.E 25.4,53.34 | 23.18,53.34 VT2.E 15.56,53.34 | 12.7,53.34 VT1.E 3.81,53.34 3.17,52.71 3.17,49.21 3.81,48.58 PING.1 PING.2 PING.3 PING.4 PING.5 PING.6 PING.7 PING.8 PING.9 PING.10 PING.11 PING.12 33.97,48.58 34.61,49.21 34.61,52.71 36.83,54.93 POW.2 43.18,52.39 50.48,52.39 C8.- C7.2 56.96,54.8 59.05,52.71 66.67,52.71 67.63,53.34 69.53,53.34 70.17,52.71 71.12,52.71 72.07,53.34 80.33,53.34 80.96,53.98 80.96,54.93 | ISP.6 27.62,29.85 C1.1 | C2.1 C11.1 2.16,22.24 C12.- 2.16,15.94 3.81,14.29 KB4.1 | v31.11,25.72 31.49,25.34 DD2.1 DD2.2 | DD2.2 DD2.3 DD2.4 | DD2.2 DD2.7 23.49,21.27 22.22,20 JMEM.4
KBDAT
  Bottom 0.305: KB1.1 15.05,37.65 DD1.12
KBIRQ
  Bottom 0.406: DD1.1 9.85,26.04 KB2.1
MISO
  Bottom 0.406: DD1.16 18.25,35.4 20,37.15 ISP.1
  Bottom 0.61: ISP.1 DISPLAY.CS
MOSI
  Bottom 0.305: 27.94,43.82 27.94,39.37 29.53,37.78 29.53,35.56 28.57,34.61 ISP.4 | 20.32,43.82 20.32,39.37 17.45,36.5 DD1.15
  Bottom 0.61: 20.32,43.82 24.13,43.82 | 24.13,43.82 DISPLAY.DC | 24.13,43.82 27.94,43.82
N$1
  Bottom 0.406: DD1.7 9.29,30.84 Z1.2
  Bottom 0.61: Z1.2 4.89,31.56 4.13,30.8 C2.2
N$2
  Bottom 0.406: DD1.8 8.89,33.91 8.89,35.88 8.38,36.39 Z1.1
  Bottom 0.61: Z1.1 4.32,36.39 C3.2
N$3
  Bottom 0.61: SW1.4 SW1.1 C8.+ C7.1 56.89,57.6 R10.1 57.66,56.33 60.01,53.98 65.72,53.98 68.9,56.2 73.34,56.2 73.66,55.88 76.52,55.88 76.83,56.2 DA1.6
N$4
  Bottom 0.61: SW1.2 SW1.5 POW.1
N$5
  Bottom 0.61: DA1.8 77.15,58.74 76.83,59.05 66.67,59.05 R11.1
N$6
  Bottom 0.61: DA1.7 L1.1 67.63,57.47 65.27,55.75 R11.2 R10.2
N$7  (via drill 0.8 pad 1.78)
  Top 0.61: v70.8,54.61 74.61,54.61 75.56,53.66 83.82,53.66 v85.09,53.02
  Bottom 0.61: v70.8,54.61 77.15,54.61 77.47,54.93 DA1.5 | R13.1 R12.2 v85.09,53.02
N$8
  Bottom 0.61: DA1.1 84.77,58.74 L1.2 86.99,58.42 93.37,58.42 VD1.A
N$9
  Bottom 0.61: C6.1 87.31,55.88 85.41,55.88 84.77,56.2 DA1.3
N$10
  Bottom 0.61: SW1.6 SW1.3
N$11
  Bottom 0.61: VT1.C HL1.K
N$12
  Bottom 0.61: R2.2 3.14,47.12 1.72,48.55 1.72,53.34 6.82,58.44 8.55,58.44 VT1.B
N$13
  Bottom 0.61: R3.1 HL1.A
N$14
  Bottom 0.61: VT2.C HL2.K
N$15
  Bottom 0.61: R4.2 VT2.B
N$16
  Bottom 0.61: HL2.A R5.1
N$17
  Bottom 0.61: VT3.C HL3.K
N$18
  Bottom 0.61: R6.2 VT3.B
N$19
  Bottom 0.61: R7.1 HL3.A
N$20
  Top 0.61: 0,58.1 0,60.64 2.54,60.64
N$21
  Bottom 0.61: R13.2 92.07,53.02 93.03,53.34 100.33,53.34 100.96,52.71 102.08,52.71 C9.+ | VD1.C 98.4,58.4 99.06,59.05 103.5,59.05 104.27,58.29 C10.2 104.27,54.89 C9.+ | L2.1 C9.+
N$22
  Top 0.61: 0,1.59 0,0 1.59,0
N$23
  Top 0.61: 111.76,1.91 111.76,0 109.85,0
N$24
  Top 0.61: 109.22,60.64 111.76,60.64 111.76,58.42
N$25
  Bottom 0.61: 109.22,60.64 111.76,60.64 111.76,58.42
N$26
  Bottom 0.61: 0,58.1 0,60.64 2.54,60.64
N$27
  Bottom 0.61: 0,1.59 0,0 1.59,0
N$28
  Bottom 0.61: 109.85,0 111.76,0 111.76,1.91
N$29  (via drill 0.8 pad 1.93)
  other vias: 1.59,1.59
N$31  (via drill 0.8 pad 1.93)
  other vias: 110.17,1.59
N$33  (via drill 0.8 pad 1.93)
  other vias: 1.59,59.05
N$34  (via drill 0.8 pad 1.93)
  other vias: 110.17,59.05
RESET  (via drill 0.8 pad 1.78)
  Top 0.61: v11.75,19.05 16.83,20 19.37,20 21.91,22.54 21.91,26.99 25.08,30.16 ISP.5
  Bottom 0.305: ISP.5 R1.1
  Bottom 0.406: DD1.29 15.05,21.78 14.92,20.95
  Bottom 0.61: 14.92,20.95 14.92,19.68 v11.75,19.05
SCK  (via drill 0.8 pad 1.78)
  Top 0.406: v20.64,35.24 20.64,38.42 21.59,39.37 DISPLAY.RES
  Bottom 0.406: ISP.3 24.45,35.24 v20.64,35.24 19.74,34.35 DD1.17
SCL
  Top 0.61: R9.1 JMEM.1
  Bottom 0.406: DD1.28 15.85,22.25 16.19,21.27 16.19,19.37 JMEM.1 14.61,16.19 15.88,14.92 24.13,14.92 26.29,17.72 DD2.5
SDA
  Bottom 0.406: DD1.27 16.65,22.4 17.46,21.27 | DD2.6 24.76,20 24.13,19.37 24.13,16.83 23.18,15.88 17.46,15.88 17.14,16.19 JMEM.2
  Bottom 0.61: JMEM.2 R8.1 17.46,21.27
U4  (1 unrouted)
  Top 0.61: S37.3 S37.4 | S43.3 S43.4 | S41.3 S41.4
  Bottom 0.61: S50.4 S43.4 | S36.3 80.64,38.04 | 80.64,38.04 S36.4 S37.4 | S41.3 S35.3 80.64,43.15 80.64,38.04 | S43.3 S37.3 | S49.3 S50.3 | S47.3 96.6,47.31 93.12,47.31 S41.4
U5  (via drill 0.8 pad 1.78)  (2 unrouted)
  Top 0.406: 96.52,25.08 95.25,23.81 82.55,23.81 82.55,23.76 S39.3
  Top 0.61: S55.3 S55.4 99.17,32.39 98.42,32.39 96.52,30.48 96.52,25.08 | v75.56,2.54 22.85,2.54 S3.4 S3.3
  Bottom 0.61: S42.3 S48.3 S48.4 S55.4 | S39.4 76.49,13.05 v75.56,13.97
U6
  Top 0.406: 57.79,16.83 73.66,16.83
  Top 0.61: S21.3 52.34,19.1 53.98,17.46 57.15,17.46 57.79,16.83 | 73.66,16.83 74.61,15.88 83.51,15.88 S45.3
  Bottom 0.406: 54.29,29.84 54.29,25.72 53.34,24.76 53.34,20.55 S21.3
  Bottom 0.61: 54.29,29.84 56.52,31.75 58.74,31.75 59.35,31.14 S25.3
U7  (1 unrouted)
  Top 0.406: 71.12,15.88 48.9,15.88 | 54.29,34.29 54.29,40.58
  Top 0.61: S16.3 S16.4 | S14.3 47.62,19.81 47.62,17.14 48.9,15.88 | 71.12,15.88 72.86,14.13 S33.3 | S14.4 47.62,28.79 47.62,31.43 48.58,32.39 52.39,32.39 54.29,34.29 | 54.29,40.58 54.29,42.48 S17.3
  Bottom 0.61: S58.4 102.34,8.26 | 102.34,8.26 S57.4 S58.3 S57.3 102.34,15.88 | S51.3 94.34,16.19 | 94.34,16.19 S51.4 96.84,10.55 96.84,9.53 98.11,8.26 102.34,8.26 | S7.3 40.01,28.19 40.01,24.45 43.53,24.45 S14.4 | S33.3 S33.4 74.86,19.55 S38.3 S38.4 S44.4 89.53,18.77 89.53,17.14 90.49,16.19 94.34,16.19 | S14.3 47.62,19.5 47.62,12.7 48.46,11.55 S16.4
U8  (2 unrouted)
  Top 0.61: S28.3 S28.4 | S23.3 S23.4
  Bottom 0.406: S46.4 90.86,10.85 88.9,8.89 65.5,8.89 64.86,9.53 S28.4 64.65,11.55 63.5,12.7 63.5,14.92 64.45,15.88 67.94,15.88 70.48,18.41 | S22.3 51.35,4.36 50.48,3.49 31.75,3.49 31.11,4.13 31.11,6.99 30.16,7.94 18.1,7.94 16.86,6.7 S2.3 | S28.3 62.61,7.3 59.11,7.3 S22.4 | 105.09,22.86 105.09,35.24 106.86,37.01 S54.3
  Bottom 0.61: S22.3 S22.4 | S54.4 S54.3 | S46.3 93.05,2.86 104.46,2.86 104.46,22.22 105.09,22.86 | S32.3 69.4,22.04 70.48,20.95 70.48,18.41
U9
  Top 0.406: 55.25,33.34 55.25,38.73 57.15,40.64
  Top 0.61: S34.3 S34.4 | S6.4 S6.3 | S15.3 S15.4 | S27.4 S27.3 | S8.3 S8.4 | 57.15,40.64 68.58,40.64 69.53,41.59 69.53,43.86 S29.4 | S19.4 55.25,31.95 55.25,33.34
  Bottom 0.406: 63.5,8.57 64.77,7.3 66.09,7.3 S34.3 | 38.73,31.75 38.73,36.45 40.32,38.04 S6.4
  Bottom 0.61: S34.4 S40.3 S40.4 84.8,6.99 92.4,6.99 S52.3 S52.4 | S15.3 42.71,14.75 41.91,15.56 40.32,15.56 38.73,17.14 38.73,26.56 | 38.73,26.56 38.73,31.75 41.64,31.75 S13.3 S13.4 S19.4 | S27.3 57.83,15.56 54.29,15.56 | 54.29,15.56 51.37,15.56 S15.4 | S8.4 38.73,26.56 | 63.5,8.57 55.25,8.57 54.29,9.53 54.29,15.56
U10
  Bottom 0.406: S53.4 99.37,48.58 79.38,48.58 | 63.82,47.62 62.87,48.58 53.02,48.58 52.55,48.26 45.56,48.26 45.4,47.94 41.59,47.94 40.96,47.31 40.96,45.15 S5.3 | 32.86,7.3 31.59,8.89 11.52,8.89 S1.4 | 33.66,16.19 33.66,27.94 34.61,28.89 34.61,35.88 33.97,36.51 33.97,39.69 34.61,40.32
  Bottom 0.61: S24.4 63.82,45.09 63.82,47.62 64.13,47.94 73.34,47.94 74.61,46.67 76.83,46.67 79.38,48.58 | S10.4 S10.3 S4.3 32.86,7.3 | S53.3 S53.4 | S5.3 38.73,42.92 38.73,42.23 36.83,40.32 34.61,40.32 | 33.66,16.19 32.07,14.61 29.84,14.61 29.53,14.92 26.04,14.92 24.76,13.65 10.79,13.65 8.86,11.72 S1.4 S1.3
U11  (1 unrouted)
  Top 0.61: S20.3 S20.4 | S9.4 S9.3 | S12.4 S12.3 | S11.3 S11.4
  Bottom 0.406: 97.79,24.13 95.57,24.13 95.25,23.81 78.74,23.81 78.42,24.13 70.8,24.13 | 61.59,38.73 66.65,38.73 S30.3
  Bottom 0.61: 64.86,23.18 65.81,24.13 70.8,24.13 | 64.86,23.18 S26.3 | S56.3 102.34,25.5 100.65,24.13 97.79,24.13 | S20.4 59.12,23.18 64.86,23.18 | S12.3 S18.3 S18.4 59.18,39.05 60.96,39.05 61.59,38.73 | S9.4 40.86,17.88 41.91,16.83 45.4,16.83 46.36,17.78 46.36,21.91 47.62,23.18 50.21,23.18 S20.3 | S11.4 S12.4 | S30.3 S31.3 S31.4 S26.4
VCC  (via drill 0.8 pad 1.78)  (1 unrouted)
  Top 0.305: DISPLAY.VCC 13.93,41.87 12.7,40.01 12.7,37.47 13.34,36.83
  Top 0.406: 9.53,22.86 11.43,22.86 13.34,24.76 13.34,36.83 | v23.81,23.18 25.08,23.81 31.43,23.81 32.7,25.08 32.7,27.3 31.11,28.89
  Top 0.61: v23.81,23.18 23.81,22.54 19.68,18.41 JMEM.3 19.68,16.51 17.78,14.61 R9.2 11.11,14.61 8.89,16.83 KB3.1 8.57,18.73 8.57,20 | PINV.12 33.66,51.12 34.61,50.16 34.61,45.09 33.66,43.82 29.84,43.82 28.89,42.86 28.89,40.01 27.62,38.73 ISP.2 29.21,37.15 31.11,35.24 31.11,28.89 | 9.53,22.86 8.57,21.91 8.57,20 | v6.99,20 8.57,20
  Bottom 0.305: ISP.2 26.35,35.88 26.35,33.34 24.13,33.34 23.81,33.66 22.86,33.97 21.98,34.04 R1.2 | C4.1 DISPLAY.VCC
  Bottom 0.406: C5.1 9.53,29.52 | 9.53,29.52 9.53,28.44 DD1.4 | 9.53,29.52 9.53,30.04 DD1.6 15.88,30.04 15.88,30.84 DD1.18 21,30.84 21.27,31.43 R1.2
  Bottom 0.61: PINV.1 PINV.2 PINV.3 PINV.4 | PINV.4 14.29,51.12 | 14.29,51.12 PINV.5 PINV.6 PINV.7 PINV.8 24.13,51.12 | 24.13,51.12 PINV.9 PINV.10 PINV.11 30.8,51.12 | 30.8,51.12 PINV.12 | R8.2 JMEM.3 | L2.2 v109.54,55.56 | 12.38,51.12 PINV.4 | R7.2 30.8,51.12 | R3.2 14.29,51.12 | R5.2 24.13,51.12 | C12.+ C11.2 v6.99,20 | DD2.8 24.76,22.54 v23.81,23.18